# Altium schematic sheet GPIO TABLE.SchDoc
size A2; Organization: Altium Limited; Address1: L3, 12a Rodborough Rd; Address2: Frenchs Forest; Address3: NSW; Address4: Australia 2086
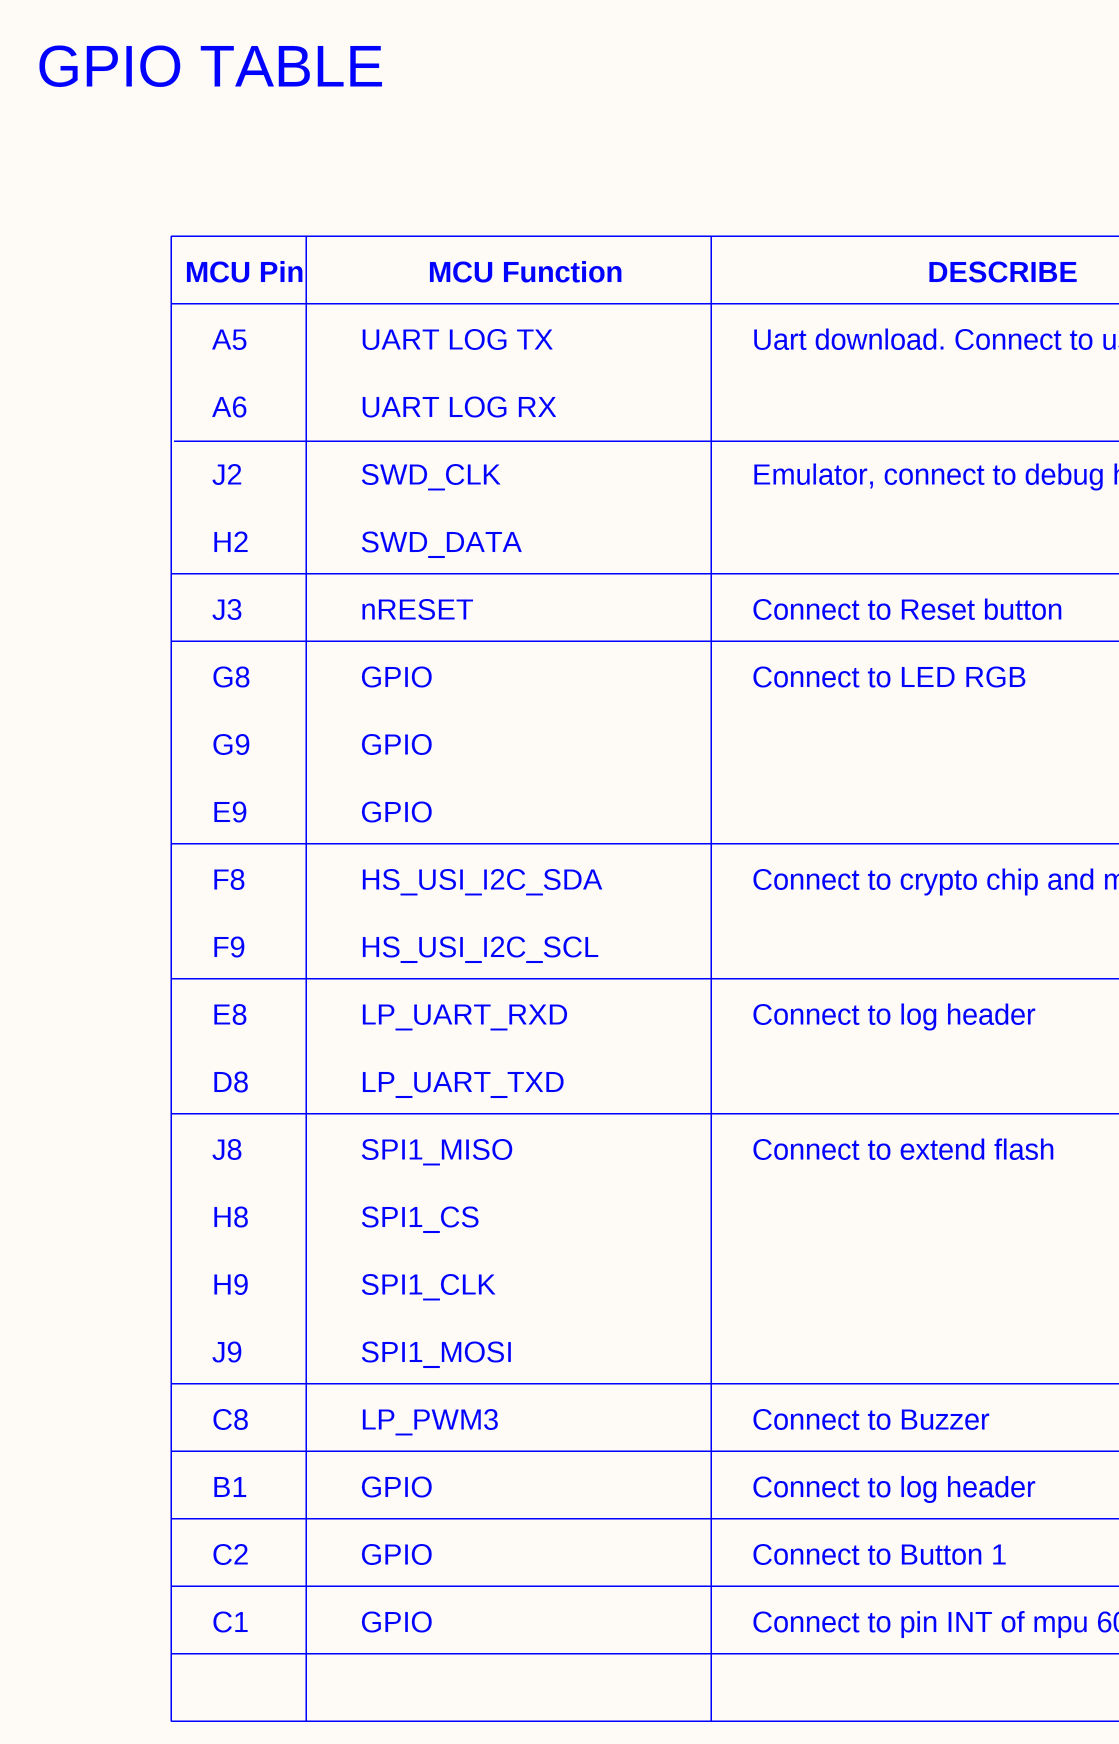
[diagram p0: GPIO TABLE.SchDoc, left]
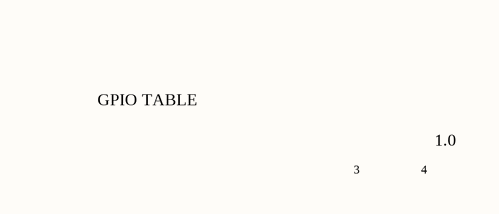
[diagram p1: GPIO TABLE.SchDoc, right]

## Notes on the sheet
- GPIO TABLE
- MCU Pin
- MCU Function
- DESCRIBE
- A5
- UART LOG TX
- Uart download. Connect to usb to ttl (cp2102)
- A6
- UART LOG RX
- J2
- SWD_CLK
- Emulator, connect to debug header
- H2
- SWD_DATA
- J3
- nRESET
- Connect to Reset button
- G8
- GPIO
- Connect to LED RGB
- G9
- E9
- F8
- HS_USI_I2C_SDA
- Connect to crypto chip and mpu 6050
- F9
- HS_USI_I2C_SCL
- E8
- LP_UART_RXD
- Connect to log header
- D8
- LP_UART_TXD
- J8
- SPI1_MISO
- Connect to extend flash
- H8
- SPI1_CS
- H9
- SPI1_CLK
- J9
- SPI1_MOSI
- C8
- LP_PWM3
- Connect to Buzzer
- B1
- C2
- Connect to Button 1
- C1
- Connect to pin INT of mpu 6050
- 3
- 4
- 1.0
- Title
- Size:
- Date:
- A4
- Number:
- Time:
- Revision:
- Sheet
- of
- File: